# EAGLE design sangaboard_v02 (EAGLE 9.0.0)
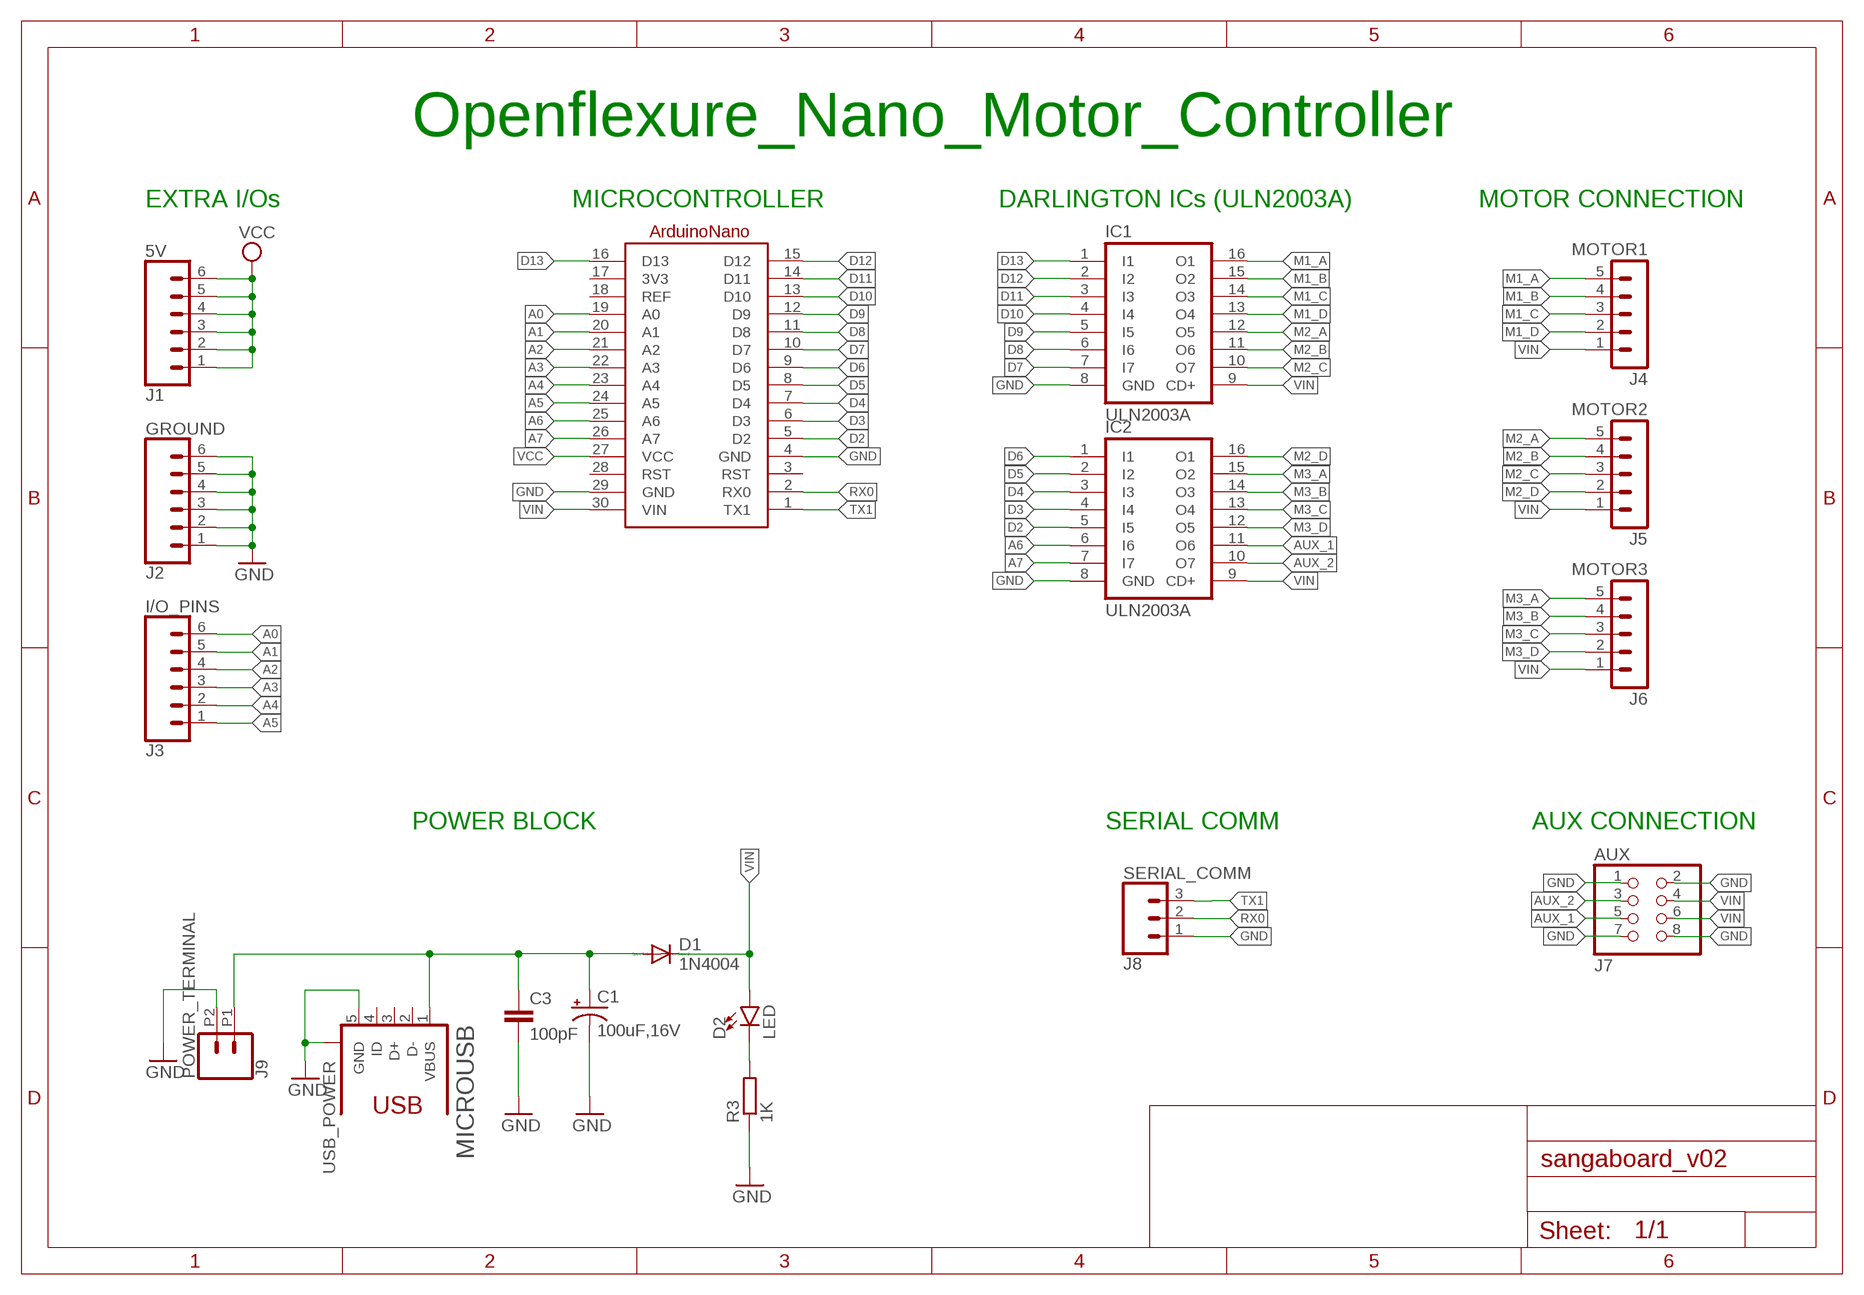
[diagram p0: schematic, sheet 1]

## Parts
5V  J1  CONN_06NO_SILK_NO_POP  [1X06_NO_SILK]
A1  Arduino Nano  ARDUINONANO  [ARDUINONANO]
AUX  J7  PINHD-2X4  [2X04]
C1  100uF,16V  100UF-POLAR-RADIAL-2.5MM-25V-20%  [CPOL-RADIAL-2.5MM-6.5MM]
C3  100pF  22PF-PTH-2.54MM-200V-5%  [CAP-PTH-2.54]
D1  1N4004  [DO41-10]
D2  LED  LED3MM  [LED_3MM]
GROUND  J2  CONN_06NO_SILK_NO_POP  [1X06_NO_SILK]
I/O_PINS  J3  CONN_06NO_SILK_NO_POP  [1X06_NO_SILK]
IC1  ULN2003A  ULN2003AN  [DIL16]
IC2  ULN2003A  ULN2003AN  [DIL16]
MICROUSB  USB_POWER  1981584-1  [1981584-1]
MOTOR1  J4  MA05-1  [MA05-1]
MOTOR2  J5  MA05-1  [MA05-1]
MOTOR3  J6  MA05-1  [MA05-1]
POWER_TERMINAL  J9  CONN_022.54MM_SCREWTERM  [1X02_2.54_SCREWTERM]
R3  1K  R-EU_0207/10  [0207/10]
SERIAL_COMM  J8  CONN_03  [1X03]

## Nets
A0: A1.19(A0) I/O_PINS.6
A1: A1.20(A1) I/O_PINS.5
A2: A1.21(A2) I/O_PINS.4
A3: A1.22(A3) I/O_PINS.3
A4: A1.23(A4) I/O_PINS.2
A5: A1.24(A5) I/O_PINS.1
A6: A1.25(A6) IC2.6(I6)
A7: A1.26(A7) IC2.7(I7)
AUX_1: AUX.5 IC2.11(O6)
AUX_2: AUX.3 IC2.10(O7)
D2: A1.5(D2) IC2.5(I5)
D3: A1.6(D3) IC2.4(I4)
D4: A1.7(D4) IC2.3(I3)
D5: A1.8(D5) IC2.2(I2)
D6: A1.9(D6) IC2.1(I1)
D7: A1.10(D7) IC1.7(I7)
D8: A1.11(D8) IC1.6(I6)
D9: A1.12(D9) IC1.5(I5)
D10: A1.13(D10) IC1.4(I4)
D11: A1.14(D11) IC1.3(I3)
D12: A1.15(D12) IC1.2(I2)
D13: A1.16(D13) IC1.1(I1)
GND: A1.4(GND) A1.29(GND) AUX.1 AUX.2 AUX.7 AUX.8 C1.2(-) C3.2 GROUND.1 GROUND.2 GROUND.3 GROUND.4 GROUND.5 GROUND.6 IC1.8(GND) IC2.8(GND) MICROUSB.5(GND) MICROUSB.S1 POWER_TERMINAL.P2 R3.1 SERIAL_COMM.1
M1_A: IC1.16(O1) MOTOR1.5
M1_B: IC1.15(O2) MOTOR1.4
M1_C: IC1.14(O3) MOTOR1.3
M1_D: IC1.13(O4) MOTOR1.2
M2_A: IC1.12(O5) MOTOR2.5
M2_B: IC1.11(O6) MOTOR2.4
M2_C: IC1.10(O7) MOTOR2.3
M2_D: IC2.16(O1) MOTOR2.2
M3_A: IC2.15(O2) MOTOR3.5
M3_B: IC2.14(O3) MOTOR3.4
M3_C: IC2.13(O4) MOTOR3.3
M3_D: IC2.12(O5) MOTOR3.2
N$1: D2.K(C) R3.2
N$2: C1.1(+) C3.1 D1.A MICROUSB.1(VBUS) POWER_TERMINAL.P1
RX0: A1.2(RX0) SERIAL_COMM.2
TX1: A1.1(TX1) SERIAL_COMM.3
VCC: 5V.1 5V.2 5V.3 5V.4 5V.5 5V.6 A1.27(VCC)
VIN: A1.30(VIN) AUX.4 AUX.6 D1.C D2.A IC1.9(CD+) IC2.9(CD+) MOTOR1.1 MOTOR2.1 MOTOR3.1
Unconnected: A1.3(RST) A1.28(RST) MICROUSB.2(D-) MICROUSB.3(D+) MICROUSB.4(ID)

## Notes on the sheet
- Openflexure_Nano_Motor_Controller
- EXTRA I/Os | MICROCONTROLLER | DARLINGTON ICs (ULN2003A) | MOTOR CONNECTION
- POWER BLOCK | SERIAL COMM | AUX CONNECTION

## Power pins joined to a net without a drawn wire
3V3: A1.17(3V3)
REF: A1.18(REF)

## Library data of the parts
5V GROUND I/O_PINS = SparkFun-Connectors:CONN_06: Multi connection point. Often used as Generic Header-pin footprint for 0.1 inch spaced/style header connections On any of the 0.1 inch spaced packages, you can populate with these: Break Away Headers - Straight <https://www.sparkfun.com/products/116> (PRT-00116) Break Away Male Headers - Right Angle <https://www.sparkfun.com/products/553> (PRT-00553) Female Headers <https://www.sparkfun.com/products/115> (PRT-00115) Break Away Headers - Machine Pin <https://www.sparkfun.com/products/117> (PRT-00117) Break Away Female Headers - Swiss Machine Pin <https://www.sparkfun.com/products/743> (PRT-00743) Arduino Stackable Header - 6 Pin <https://www.sparkfun.com/products/9280> (PRT-09280) For SCREWTERMINALS and SPRING TERMINALS visit here: Screw Terimnals on SparkFun.com <https://www.sparkfun.com/search/results?term=Screw+Terminals> (5mm/3.5mm/2.54mm spacing) This device is also useful as a general connection point to wire up your design to another part of your project. Our various solder wires solder well into these plated through hole pads. Hook-Up Wire - Assortment (Stranded, 22 AWG) <https://www.sparkfun.com/products/11375> (PRT-11375) Hook-Up Wire - Assortment (Solid Core, 22 AWG) <https://www.sparkfun.com/products/11367> (PRT-11367) View the entire wire category on our website here <https://www.sparkfun.com/categories/141>
A1 = ArduinoNano:ARDUINONANO
AUX = pinhead:PINHD-2X4: PIN HEADER
C1 = SparkFun-Capacitors:100UF-POLAR: 100µF polarized capacitors A capacitor is a passive two-terminal electrical component used to store electrical energy temporarily in an electric field.; PROD_ID: CAP-08439; VALUE: 100uF
C3 = SparkFun-Capacitors:22PF: 22pF ceramic capacitors A capacitor is a passive two-terminal electrical component used to store electrical energy temporarily in an electric field.; PROD_ID: CAP-09128; VALUE: 22pF
D1 = diode:1N4004: DIODE general purpose rectifier, 1 A
D2 = SparkFun-LED:LED: LED (Generic) Standard schematic elements and footprints for 5mm, 3mm, 1206, and 0603 sized LEDs. Generic LEDs with no color specified.; PROD_ID: DIO-08794
IC1 IC2 = ULN2003A:ULN2003A: DRIVER ARRAY; AVAILABILITY: Unavailable; DESCRIPTION: IC PWR RELAY 7NPN 1:1 16DIP; MF: STMicroelectronics; MP: ULN2003A; PACKAGE: DIP-16 Rochester Electronics; PRICE: None
MICROUSB = audio amplifier example:1981584-1: Receptacle, micro-USB, type A/B Tyco Electronics
MOTOR1-MOTOR3 = con-lstb:MA05-1: PIN HEADER; OC_FARNELL: unknown; OC_NEWARK: unknown
POWER_TERMINAL = SparkFun-Connectors:CONN_02: Multi connection point. Often used as Generic Header-pin footprint for 0.1 inch spaced/style header connections On any of the 0.1 inch spaced packages, you can populate with these: Break Away Headers - Straight <https://www.sparkfun.com/products/116> (PRT-00116) Break Away Male Headers - Right Angle <https://www.sparkfun.com/products/553> (PRT-00553) Female Headers <https://www.sparkfun.com/products/115> (PRT-00115) Break Away Headers - Machine Pin <https://www.sparkfun.com/products/117> (PRT-00117) Break Away Female Headers - Swiss Machine Pin <https://www.sparkfun.com/products/743> (PRT-00743) For SCREWTERMINALS and SPRING TERMINALS visit here: Screw Terimnals on SparkFun.com <https://www.sparkfun.com/search/results?term=Screw+Terminals> (5mm/3.5mm/2.54mm spacing) This device is also useful as a general connection point to wire up your design to another part of your project. Our various solder wires solder well into these plated through hole pads. Hook-Up Wire - Assortment (Stranded, 22 AWG) <https://www.sparkfun.com/products/11375> (PRT-11375) Hook-Up Wire - Assortment (Solid Core, 22 AWG) <https://www.sparkfun.com/products/11367> (PRT-11367) View the entire wire category on our website here <https://www.sparkfun.com/categories/141> Special notes: Molex polarized connector foot print use with: PRT-08233 with associated crimp pins and housings. 2.54_SCREWTERM for use with PRT-10571. 3.5mm Screw Terminal footprints for PRT-08084 5mm Screw Terminal footprints for use with PRT-08432
R3 = rcl:R-EU_: RESISTOR, European symbol; SPICEPREFIX: R
SERIAL_COMM = SparkFun-Connectors:CONN_03: Multi connection point. Often used as Generic Header-pin footprint for 0.1 inch spaced/style header connections On any of the 0.1 inch spaced packages, you can populate with these: Break Away Headers - Straight <https://www.sparkfun.com/products/116> (PRT-00116) Break Away Male Headers - Right Angle <https://www.sparkfun.com/products/553> (PRT-00553) Female Headers <https://www.sparkfun.com/products/115> (PRT-00115) Break Away Headers - Machine Pin <https://www.sparkfun.com/products/117> (PRT-00117) Break Away Female Headers - Swiss Machine Pin <https://www.sparkfun.com/products/743> (PRT-00743) Stackable Header - 3 Pin (Female, 0.1") <https://www.sparkfun.com/products/13875> (PRT-13875) For SCREWTERMINALS and SPRING TERMINALS visit here: Screw Terimnals on SparkFun.com <https://www.sparkfun.com/search/results?term=Screw+Terminals> (5mm/3.5mm/2.54mm spacing) This device is also useful as a general connection point to wire up your design to another part of your project. Our various solder wires solder well into these plated through hole pads. Hook-Up Wire - Assortment (Stranded, 22 AWG) <https://www.sparkfun.com/products/11375> (PRT-11375) Hook-Up Wire - Assortment (Solid Core, 22 AWG) <https://www.sparkfun.com/products/11367> (PRT-11367) View the entire wire category on our website here <https://www.sparkfun.com/categories/141> Special notes: Molex polarized connector foot print use with SKU : PRT-08232 with associated crimp pins and housings.; PROD_ID: XXX-00000; VALUE: 455-1750-1-ND

## Board
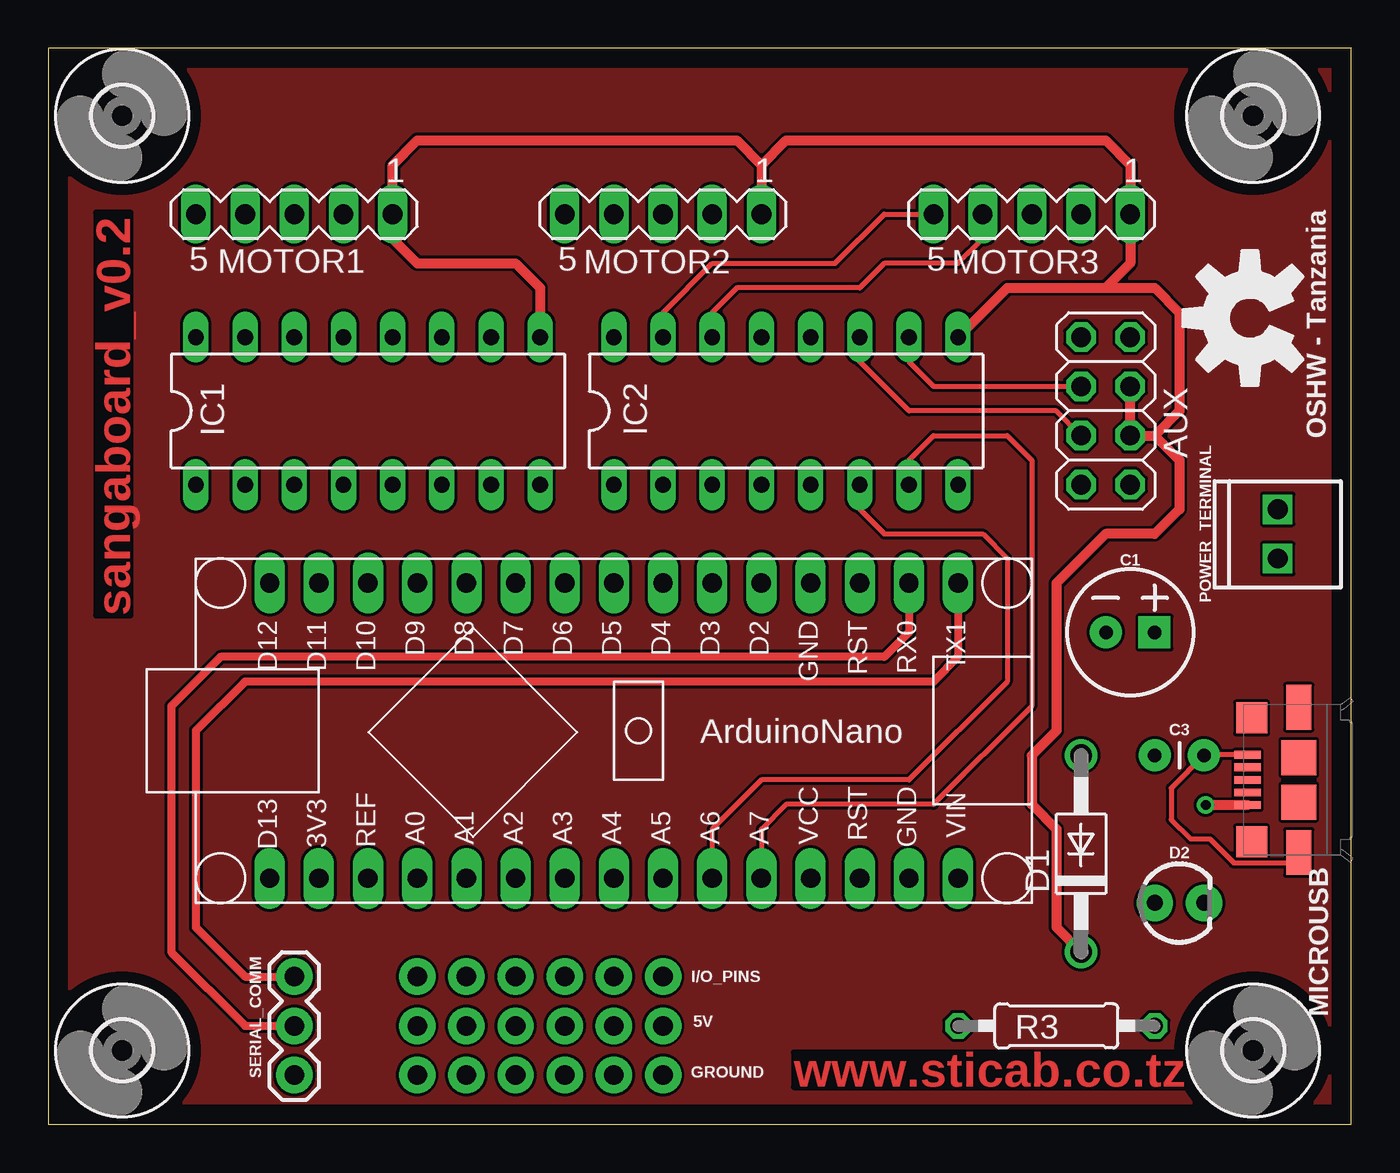
[diagram p1: board, top side]
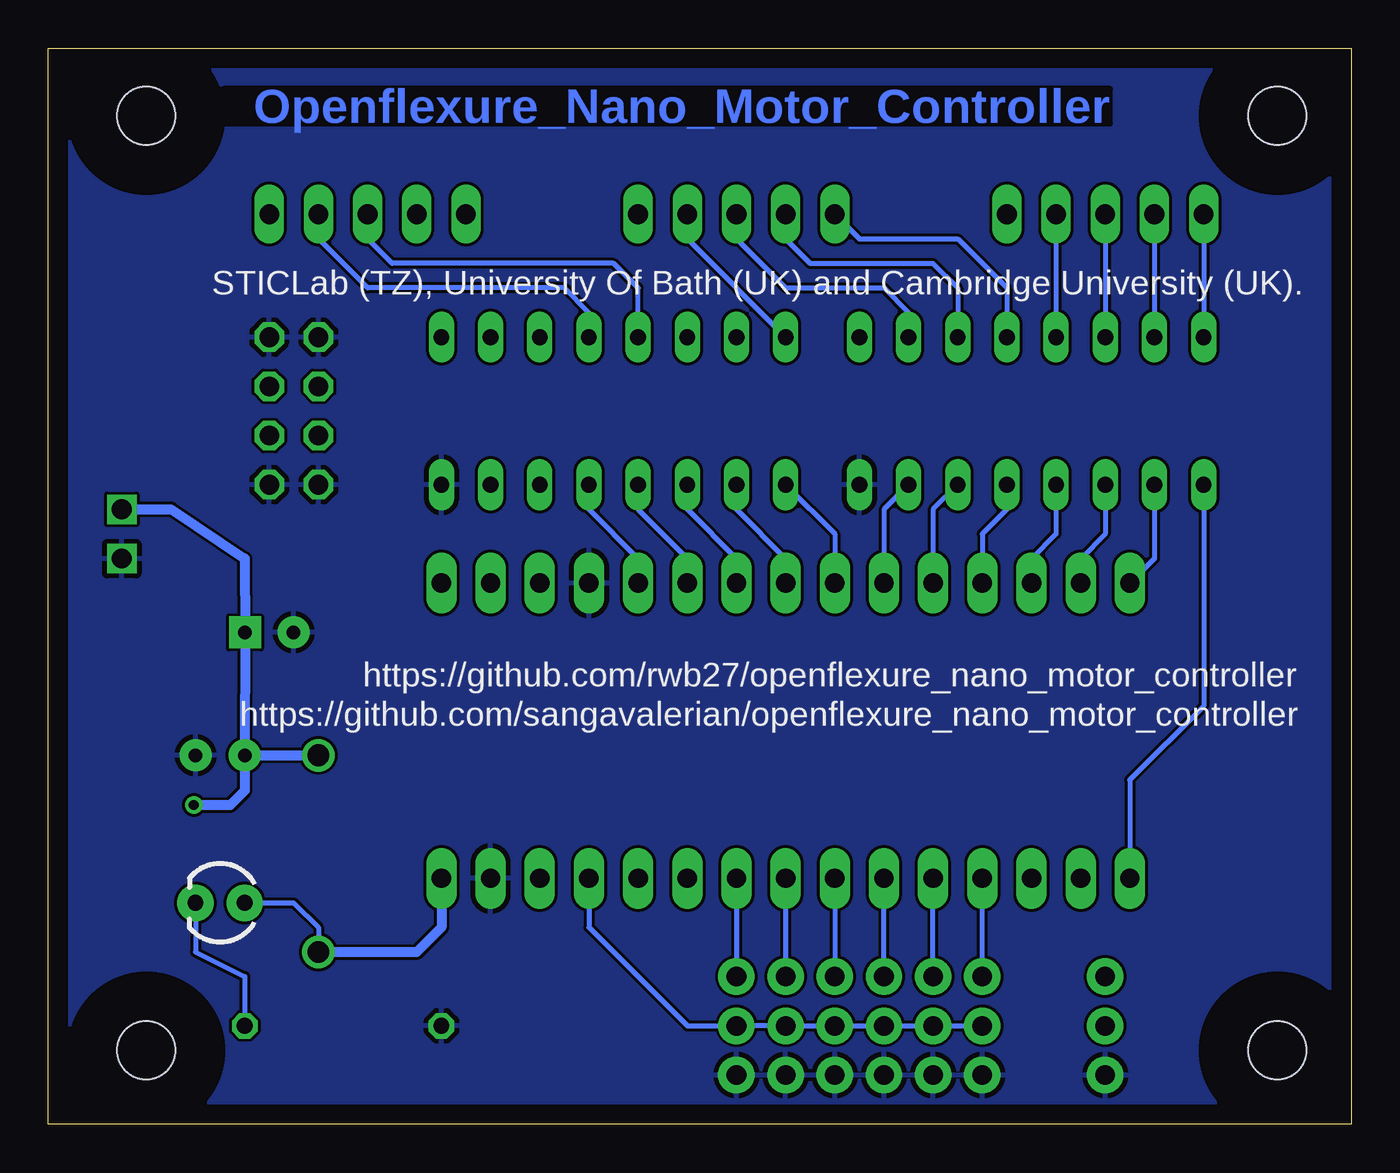
[diagram p2: board, bottom side, seen from below]

Size 67.29 x 55.55 mm. Coordinates in mm from the lower left corner, seen from the top.
Outline: 0,0 67.29,0 67.29,55.55 0,55.55 0,0
Copper layers (1*16): Top 0.035mm / dielectric 1.5mm / Bottom 0.035mm
Design rules "default": minimum track width 6mil, minimum drill 0.35mm, track to track 6mil, track to pad 6mil, pad to pad 6mil, via to via 6mil, smd to smd 6mil, copper to edge 40mil, drill to drill 6mil, minimum pad ring 10mil, minimum via ring 8mil, stop-mask expansion 4mil, vias tented up to drill 0mil, thermal gap 10mil

### Footprints (pad centres in the part's own frame; a part is rotated, then mirrored left to right if it is on the bottom)
1X06_NO_SILK = drill 1.016 pad 1.88: 1 0,0; 2 2.54,0; 3 5.08,0; 4 7.62,0; 5 10.16,0; 6 12.7,0
ARDUINONANO = drill 1 pad 1.575 long: 1 -7.62,16.51; 2 -7.62,13.97; 3 -7.62,11.43; 4 -7.62,8.89; 5 -7.62,6.35; 6 -7.62,3.81; 7 -7.62,1.27; 8 -7.62,-1.27; 9 -7.62,-3.81; 10 -7.62,-6.35; 11 -7.62,-8.89; 12 -7.62,-11.43; 13 -7.62,-13.97; 14 -7.62,-16.51; 15 -7.62,-19.05; 16 7.62,-19.05; 17 7.62,-16.51; 18 7.62,-13.97; 19 7.62,-11.43; 20 7.62,-8.89; 21 7.62,-6.35; 22 7.62,-3.81; 23 7.62,-1.27; 24 7.62,1.27; 25 7.62,3.81; 26 7.62,6.35; 27 7.62,8.89; 28 7.62,11.43; 29 7.62,13.97; 30 7.62,16.51
2X04 = drill 1.016 octagon: 1 -3.81,-1.27; 2 -3.81,1.27; 3 -1.27,-1.27; 4 -1.27,1.27; 5 1.27,-1.27; 6 1.27,1.27; 7 3.81,-1.27; 8 3.81,1.27
CPOL-RADIAL-2.5MM-6.5MM = drill 0.7 pad 1.651 square: 1 1.25,0 | drill 0.7 pad 1.651: 2 -1.25,0
CAP-PTH-2.54 = drill 0.7 pad 1.651: 1 -1.27,0; 2 1.27,0
DO41-10 = drill 1.118: A 5.08,0; C -5.08,0
LED_3MM = drill 0.813 pad 1.88: A -1.27,0; K 1.27,0
DIL16 = drill 0.813 long: 1 -8.89,-3.81; 2 -6.35,-3.81; 3 -3.81,-3.81; 4 -1.27,-3.81; 5 1.27,-3.81; 6 3.81,-3.81; 7 6.35,-3.81; 8 8.89,-3.81; 9 8.89,3.81; 10 6.35,3.81; 11 3.81,3.81; 12 1.27,3.81; 13 -1.27,3.81; 14 -3.81,3.81; 15 -6.35,3.81; 16 -8.89,3.81
1981584-1 = smd 0.4 x 1.35: 1 -1.3,4.1; 2 -0.65,4.1; 3 0,4.1; 4 0.65,4.1; 5 1.3,4.1 | smd 1.8 x 1.8: M1 -1.15,1.45; M2 1.15,1.45 | smd 2.3 x 1.3: S1 -3.75,1.45; S2 3.75,1.45 | smd 1.6 x 1.6: S3 -3.2,3.885; S4 3.2,3.885
MA05-1 = drill 1.016 long: 1 -5.08,0; 2 -2.54,0; 3 0,0; 4 2.54,0; 5 5.08,0
1X02_2.54_SCREWTERM = drill 1.016 square: P1 2.54,0; P2 0,0
0207/10 = drill 0.813 octagon: 1 -5.08,0; 2 5.08,0
1X03 = drill 1.016 pad 1.88: 1 0,0; 2 2.54,0; 3 5.08,0
3,0 = hole 3: 0,0

### Placement (x,y rotation side)
5V  19.05,5.08 0 top
A1  30.48,20.32 270 top
AUX  54.61,36.83 270 top
C1  55.88,25.4 0 top
C3  58.42,19.05 0 top
D1  53.34,13.97 90 top
D2  58.42,11.43 0 top
GROUND  19.05,2.54 0 top
I/O_PINS  31.75,7.62 180 top
IC1  16.51,36.83 0 top
IC2  38.1,36.83 0 top
MICROUSB  66.04,17.78 90 top
MOTOR1  12.7,46.99 180 top
MOTOR2  31.75,46.99 180 top
MOTOR3  50.8,46.99 180 top
POWER_TERMINAL  63.5,29.21 90 top
R3  52.07,5.08 0 top
SERIAL_COMM  12.7,2.54 90 top
U$1  [3,0]  3.81,3.81 0 top
U$2  [3,0]  62.23,3.81 0 top
U$3  [3,0]  3.81,52.07 0 top
U$4  [3,0]  62.23,52.07 0 top
U$5  [OSHW-LOGO-L]  62.06,41.62 90 top

### Tracks (layer width: path | path; a pad name or v marks a point on that pad's centre or on a via)
A0
  Bottom 0.254: I/O_PINS.6 A1.19
A1
  Bottom 0.254: I/O_PINS.5 A1.20
A2
  Bottom 0.254: I/O_PINS.4 A1.21
A3
  Bottom 0.254: A1.22 I/O_PINS.3
A4
  Bottom 0.254: A1.23 I/O_PINS.2
A5
  Bottom 0.254: A1.24 I/O_PINS.1
A6
  Top 0.254: IC2.6 41.91,31.75 43.18,30.48 48.26,30.48 49.53,29.21 49.53,22.86 44.45,17.78 36.83,17.78 34.29,15.24 A1.25
A7
  Top 0.254: IC2.7 44.45,34.29 45.72,35.56 49.53,35.56 50.8,34.29 50.8,21.59 45.72,16.51 38.1,16.51 36.83,15.24 A1.26
AUX_1
  Top 0.254: AUX.5 52.07,36.83 44.45,36.83 41.91,39.37 IC2.11
AUX_2
  Top 0.254: IC2.10 44.45,39.37 45.72,38.1 AUX.3
D2
  Bottom 0.254: A1.5 36.83,29.21 39.37,31.75 IC2.5
D3
  Bottom 0.254: IC2.4 36.83,31.75 34.29,29.21 A1.6
D4
  Bottom 0.254: IC2.3 34.29,31.75 31.75,29.21 A1.7
D5
  Bottom 0.254: IC2.2 31.75,31.75 29.21,29.21 A1.8
D6
  Bottom 0.254: IC2.1 26.67,30.48 A1.9
D7
  Bottom 0.254: IC1.7 24.13,31.75 A1.10
D8
  Bottom 0.254: IC1.6 21.59,31.75 A1.11
D9
  Bottom 0.254: IC1.5 17.78,31.75 19.05,30.48 A1.12
D10
  Bottom 0.254: IC1.4 15.24,30.48 16.51,29.21 A1.13
D11
  Bottom 0.254: IC1.3 12.7,30.48 13.97,29.21 A1.14
D12
  Bottom 0.254: IC1.2 10.16,29.21 A1.15
D13
  Bottom 0.254: IC1.1 7.62,21.59 11.43,17.78 A1.16
GND
  Top 0.254: MICROUSB.5 59.72,19.08 C3.2 58,17.36 58,15.73 59,14.73 60,14.73 61.23,13.5 64.06,13.5 MICROUSB.S1
  pour Bottom: 0,55.88 0,0 67.31,0 67.31,55.88
M1_A
  Bottom 0.254: MOTOR1.5 IC1.16
M1_B
  Bottom 0.254: MOTOR1.4 IC1.15
M1_C
  Bottom 0.254: MOTOR1.3 IC1.14
M1_D
  Bottom 0.254: MOTOR1.2 IC1.13
M2_A
  Bottom 0.254: MOTOR2.5 25.4,45.72 20.32,45.72 17.78,43.18 IC1.12
M2_B
  Bottom 0.254: MOTOR2.4 29.21,45.72 27.94,44.45 21.59,44.45 20.32,43.18 IC1.11
M2_C
  Bottom 0.254: MOTOR2.3 31.75,45.72 29.21,43.18 24.13,43.18 22.86,41.91 IC1.10
M2_D
  Bottom 0.254: MOTOR2.2 34.29,45.72 IC2.16
M3_A
  Top 0.254: IC2.15 31.75,41.91 34.29,44.45 40.64,44.45 43.18,46.99 MOTOR3.5
M3_B
  Top 0.254: IC2.14 34.29,41.91 35.56,43.18 41.91,43.18 43.18,44.45 46.99,44.45 48.26,45.72 MOTOR3.4
M3_C
  Bottom 0.254: MOTOR3.3 50.8,45.72 49.53,44.45 38.1,44.45 36.83,43.18 IC2.13
M3_D
  Bottom 0.254: IC2.12 39.37,41.91 40.64,43.18 50.8,43.18 53.34,45.72 MOTOR3.2
N$1
  Bottom 0.254: D2.K 59.69,8.89 57.15,7.62 R3.2
N$2  (via drill 0.51)
  Top 0.508: MICROUSB.1 v59.78,16.48
  Bottom 0.508: POWER_TERMINAL.P1 60.96,31.75 57.15,29.21 C1.1 C3.1 | C3.1 D1.A | v59.78,16.48 57.89,16.48 57.15,17.22 C3.1
N$3
  pour Top: 0,55.73 0,-0.27 67,-0.27 67,55.73
RX0
  Top 0.406: A1.2 44.45,25.4 43.18,24.13 8.89,24.13 6.35,21.59 6.35,8.89 10.16,5.08 SERIAL_COMM.2
TX1
  Top 0.406: A1.1 46.99,24.13 45.72,22.86 10.16,22.86 7.62,20.32 7.62,10.16 10.16,7.62 SERIAL_COMM.3
VCC
  Bottom 0.254: A1.27 39.37,10.16 34.29,5.08 5V.6 5V.5 5V.4 5V.3 5V.2 5V.1
VIN
  Top 0.508: 57.15,35.56 AUX.6 AUX.4 | 57.15,35.56 58.42,34.29 58.42,31.75 57.15,30.48 54.61,30.48 52.07,27.94 52.07,20.32 50.8,19.05 50.8,16.51 52.07,15.24 52.07,10.16 D1.C | IC2.9 49.53,43.18 54.61,43.18 | 57.15,35.56 58.42,36.83 58.42,41.91 57.15,43.18 54.61,43.18 | 36.83,49.53 35.56,50.8 19.05,50.8 17.78,49.53 MOTOR1.1 17.78,45.72 19.05,44.45 24.13,44.45 25.4,43.18 IC1.9 | 36.83,49.53 MOTOR2.1 | 36.83,49.53 38.1,50.8 54.61,50.8 55.88,49.53 MOTOR3.1 55.88,44.45 54.61,43.18
  Bottom 0.254: D2.A 54.61,11.43 53.34,10.16 D1.C
  Bottom 0.406: 47.71,9.44
  Bottom 0.508: A1.30 46.99,10.16 47.71,9.44 48.26,8.89 D1.C

### Text on the board
Top: sangaboard_v0.2 | www.sticab.co.tz
Bottom: Openflexure_Nano_Motor_Controller
tNames: OSHW - Tanzania
bNames: STICLab (TZ), University Of Bath (UK) and Cambridge University (UK). | https://github.com/rwb27/openflexure_nano_motor_controller | https://github.com/sangavalerian/openflexure_nano_motor_controller